# EAGLE schematic lcd_display_board (EAGLE 7.7.0)
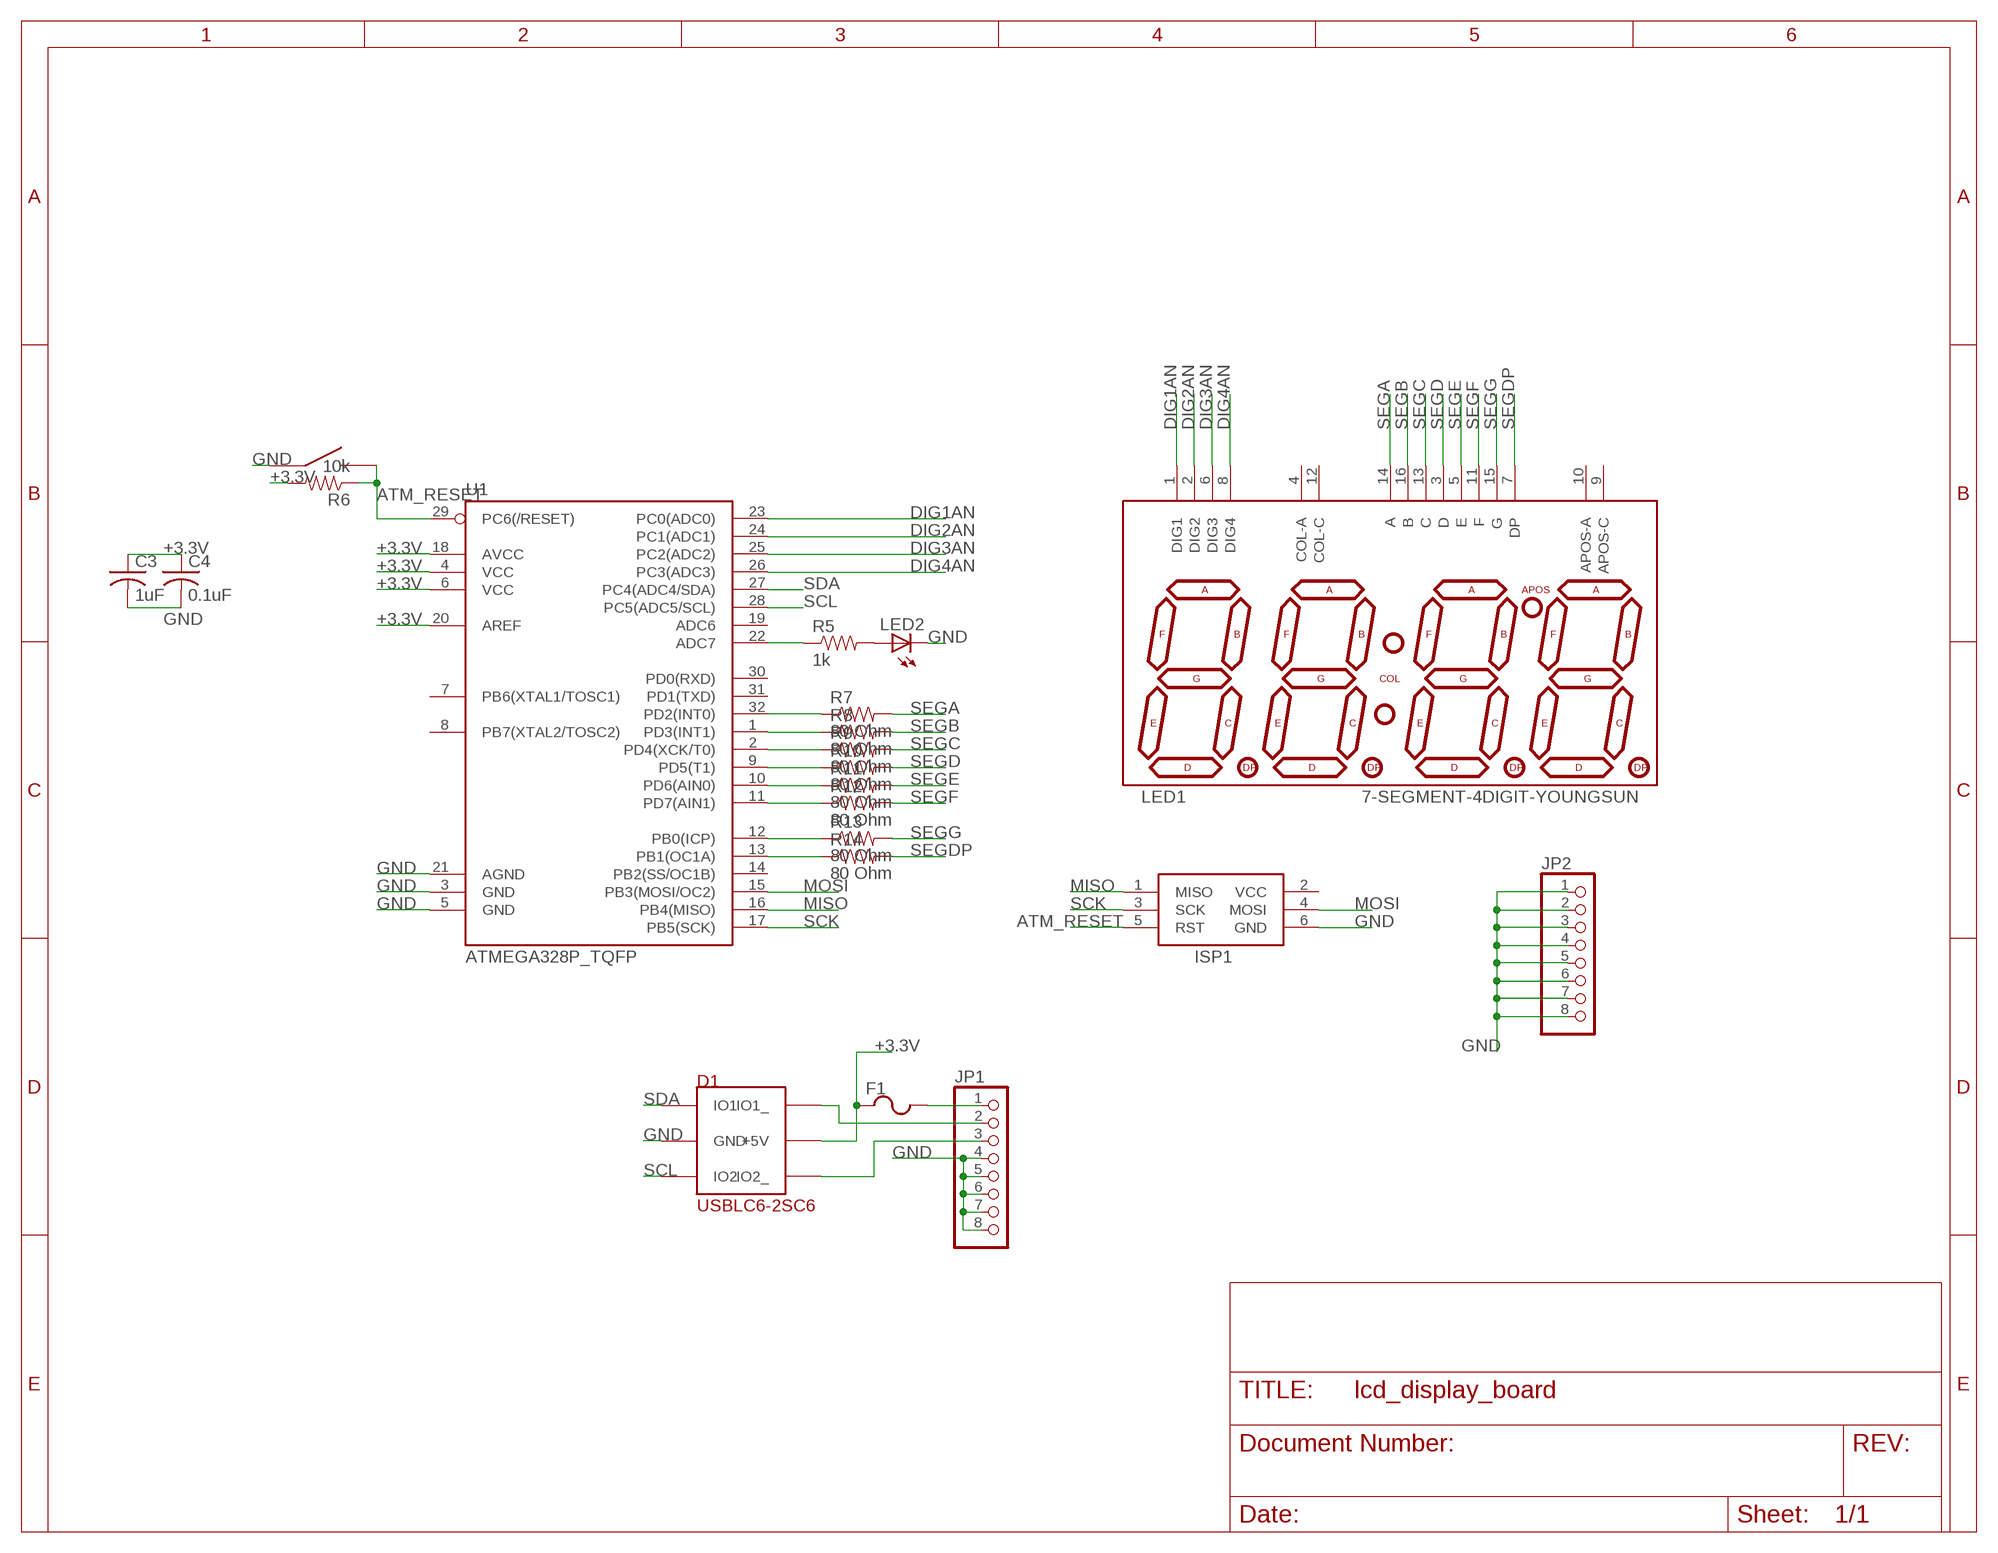
[diagram p0: schematic, sheet 1]

## Parts
C3  1uF  C-USC0805  [C0805]
C4  0.1uF  C-USC0805  [C0805]
D1  USBLC6-2SC6  [USBLC6-2SC6]
F1  POLYFUSE  [1206]
ISP1  AVRISP-BOX  [AVRISP-BOX]
JP1  PINHD-1X8BIG  [1X08-BIG]
JP2  PINHD-1X8BIG  [1X08-BIG]
LED1  7-SEGMENT-4DIGIT-YOUNGSUN  [7-SEGMENT-4DIGIT-YOUNGSUN]
LED2  LEDCHIPLED_0805  [CHIPLED_0805]
R5  1k  RESISTOR0603-RES  [0603-RES]
R6  10k  RESISTOR0603-RES  [0603-RES]
R7  80 Ohm  RESISTOR0603-RES  [0603-RES]
R8  80 Ohm  RESISTOR0603-RES  [0603-RES]
R9  80 Ohm  RESISTOR0603-RES  [0603-RES]
R10  80 Ohm  RESISTOR0603-RES  [0603-RES]
R11  80 Ohm  RESISTOR0603-RES  [0603-RES]
R12  80 Ohm  RESISTOR0603-RES  [0603-RES]
R13  80 Ohm  RESISTOR0603-RES  [0603-RES]
R14  80 Ohm  RESISTOR0603-RES  [0603-RES]
U1  ATMEGA328P_TQFP  [TQFP32-08]
U$10  EG4621CT-ND  [EG4621CT-ND]

## Nets
+3.3V: C3.1 C4.1 D1.P$5(+5V) F1.1 R6.2 U1.4(VCC) U1.6(VCC) U1.18(AVCC) U1.20(AREF)
ATM_RESET: ISP1.5(RST) R6.1 U1.29(PC6(/RESET)) U$10.P$3 U$10.P$4
DIG1AN: LED1.1(DIG1) U1.23(PC0(ADC0))
DIG2AN: LED1.2(DIG2) U1.24(PC1(ADC1))
DIG3AN: LED1.6(DIG3) U1.25(PC2(ADC2))
DIG4AN: LED1.8(DIG4) U1.26(PC3(ADC3))
GND: C3.2 C4.2 D1.P$2(GND) ISP1.6(GND) JP1.4 JP1.5 JP1.6 JP1.7 JP1.8 JP2.1 JP2.2 JP2.3 JP2.4 JP2.5 JP2.6 JP2.7 JP2.8 LED2.C U1.3(GND) U1.5(GND) U1.21(AGND) U$10.P$1 U$10.P$2
MISO: ISP1.1(MISO) U1.16(PB4(MISO))
MOSI: ISP1.4(MOSI) U1.15(PB3(MOSI/OC2))
N$3: F1.2 JP1.1
N$6: D1.P$6(IO1_) JP1.2
N$7: R5.1 U1.22(ADC7)
N$8: LED2.A R5.2
N$9: R7.1 U1.32(PD2(INT0))
N$10: R8.1 U1.1(PD3(INT1))
N$11: R9.1 U1.2(PD4(XCK/T0))
N$12: R10.1 U1.9(PD5(T1))
N$13: R11.1 U1.10(PD6(AIN0))
N$14: R12.1 U1.11(PD7(AIN1))
N$15: R13.1 U1.12(PB0(ICP))
N$16: R14.1 U1.13(PB1(OC1A))
N$17: D1.P$4(IO2_) JP1.3
SCK: ISP1.3(SCK) U1.17(PB5(SCK))
SCL: D1.P$3(IO2) U1.28(PC5(ADC5/SCL))
SDA: D1.P$1(IO1) U1.27(PC4(ADC4/SDA))
SEGA: LED1.14(A) R7.2
SEGB: LED1.16(B) R8.2
SEGC: LED1.13(C) R9.2
SEGD: LED1.3(D) R10.2
SEGDP: LED1.7(DP) R14.2
SEGE: LED1.5(E) R11.2
SEGF: LED1.11(F) R12.2
SEGG: LED1.15(G) R13.2
Unconnected: LED1.4(COL-A) LED1.9(APOS-C) LED1.10(APOS-A) LED1.12(COL-C) U1.7(PB6(XTAL1/TOSC1)) U1.8(PB7(XTAL2/TOSC2)) U1.14(PB2(SS/OC1B)) U1.19(ADC6) U1.30(PD0(RXD)) U1.31(PD1(TXD))

## Power pins joined to a net without a drawn wire
VCC: ISP1.2(VCC)

## Library data of the parts
C3 C4 = adafruit:C-US: CAPACITOR, American symbol
D1 = USBLC6-2SC6:USBLC6-2SC6: 5V TSV diode for protecting circuit board inputs. Also has Vcc Protection. Digikey 497-5235-6-ND
F1 = polyfuse:POLYFUSE: Resistor Basic schematic elements and footprints for 0603, 1206, and PTH resistors.
ISP1 = adafruit:AVRISP: AVR ISP HEADER Standard 6 pin header for AVR programming
JP1 JP2 = adafruit:PINHD-1X8: PIN HEADER
LED1 = SparkFun-Displays:7-SEGMENT-4DIGIT-YOUNGSUN: This is a part for the 4-Digit 7-segment LEDs from Young Sun. Different from the Digikey LEDs, all 16 pins are used. The LONGPADS Variant is used for a test jig, but you may like it because there is more pad to solder to. If you are concerned about routing space, the standard works just fine though.
LED2 = adafruit:LED: LED OSRAM: - CHIPLED LG R971, LG N971, LY N971, LG Q971, LY Q971, LO R971, LY R971 LH N974, LH R974 LS Q976, LO Q976, LY Q976 LO Q996 - Hyper CHIPLED LW Q18S LB Q993, LB Q99A, LB R99A - SideLED LS A670, LO A670, LY A670, LG A670, LP A670 LB A673, LV A673, LT A673, LW A673 LH A674 LY A675 LS A676, LA A676, LO A676, LY A676, LW A676 LS A679, LY A679, LG A679 - Hyper Micro SIDELED® LS Y876, LA Y876, LO Y876, LY Y876 LT Y87S - SmartLED LW L88C, LW L88S LB L89C, LB L89S, LG L890 LS L89K, LO L89K, LY L89K LS L896, LA L896, LO L896, LY L896 - TOPLED LS T670, LO T670, LY T670, LG T670, LP T670 LSG T670, LSP T670, LSY T670, LOP T670, LYG T670 LG T671, LOG T671, LSG T671 LB T673, LV T673, LT T673, LW T673 LH T674 LS T676, LA T676, LO T676, LY T676, LB T676, LH T676, LSB T676, LW T676 LB T67C, LV T67C, LT T67C, LS T67K, LO T67K, LY T67K, LW E67C LS E67B, LA E67B, LO E67B, LY E67B, LB E67C, LV E67C, LT E67C LW T67C LS T679, LY T679, LG T679 LS T770, LO T770, LY T770, LG T770, LP T770 LB T773, LV T773, LT T773, LW T773 LH T774 LS E675, LA E675, LY E675, LS T675 LS T776, LA T776, LO T776, LY T776, LB T776 LHGB T686 LT T68C, LB T68C - Hyper Mini TOPLED® LB M676 - Mini TOPLED Santana® LG M470 LS M47K, LO M47K, LY M47K Source: http://www.osram.convergy.de/
R5-R14 = SparkFun-Resistors:RESISTOR: Resistor Basic schematic elements and footprints for 0603, 1206, and PTH resistors.
U1 = SparkFun-DigitalIC:ATMEGA328P_TQFP; PROD_ID: IC-09069
U$10 = EG4621CT-ND:EG4621CT-ND: surface mount push putton digikey number EG4621CT-ND